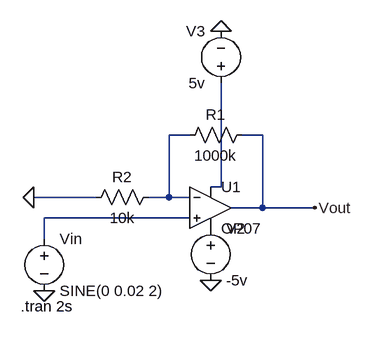
[diagram p0: schematic PreAmplifierBlock.asc]
PreAmplifierBlock.asc, the LTspice schematic file:
Version 4
SHEET 1 880 680
WIRE 160 48 128 48
WIRE 272 48 240 48
WIRE 208 128 208 -32
WIRE 208 128 192 128
WIRE 16 144 -80 144
WIRE 128 144 128 48
WIRE 128 144 96 144
WIRE 160 144 128 144
WIRE 272 160 272 48
WIRE 272 160 224 160
WIRE 352 160 272 160
WIRE 160 176 -64 176
WIRE -64 208 -64 176
FLAG -80 144 0
FLAG -64 288 0
FLAG 208 -112 0
FLAG 192 272 0
FLAG 352 160 Vout
SYMBOL OpAmps\\OP07 192 96 R0
SYMATTR InstName U1
SYMBOL res 256 32 R90
WINDOW 0 0 56 VBottom 2
WINDOW 3 32 56 VTop 2
SYMATTR InstName R1
SYMATTR Value 1000k
SYMBOL res 112 128 R90
WINDOW 0 0 56 VBottom 2
WINDOW 3 32 56 VTop 2
SYMATTR InstName R2
SYMATTR Value 10k
SYMBOL voltage -64 192 R0
WINDOW 123 0 0 Left 0
WINDOW 39 0 0 Left 0
SYMATTR InstName Vin
SYMATTR Value SINE(0 0.02 2)
SYMBOL voltage 192 176 R0
SYMATTR InstName V2
SYMATTR Value -5v
SYMBOL voltage 208 -16 R180
WINDOW 0 24 96 Left 2
WINDOW 3 24 16 Left 2
SYMATTR InstName V3
SYMATTR Value 5v
TEXT -100 312 Left 2 !.tran 2s

The netlist it stands for:
* PreAmplifierBlock.asc
XU1 N003 N001 N002 P001 Vout LT1001  ; OP07, pins In+ In- V+ V- OUT
R1 Vout N001 1000k
R2 N001 0 10k
Vin N003 0 SINE(0 0.02 2)
V2 P001 0 -5v
V3 N002 0 5v
.tran 2s
.lib LTC.lib
.backanno
.end